# EAGLE schematic untitled (EAGLE 6.1)
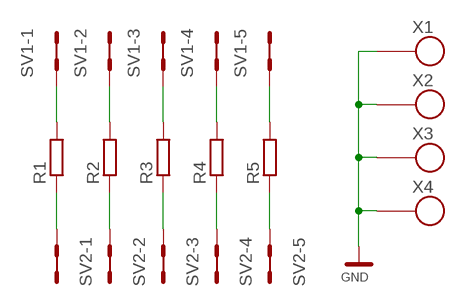
[diagram p0: schematic, sheet 1]

## Parts
R1  R0805  [0805]
R2  R0805  [0805]
R3  R0805  [0805]
R4  R0805  [0805]
R5  R0805  [0805]
SV1  MA05-2  [MA05-2]
SV2  MA05-2  [MA05-2]
X1  SROUB3M  [SROUB3M]
X2  SROUB3M  [SROUB3M]
X3  SROUB3M  [SROUB3M]
X4  SROUB3M  [SROUB3M]

## Nets
GND: X1.P$1 X2.P$1 X3.P$1 X4.P$1
N$1: R1.1 SV2.1 SV2.2
N$2: R2.1 SV2.3 SV2.4
N$3: R3.1 SV2.5 SV2.6
N$4: R4.1 SV2.7 SV2.8
N$5: R1.2 SV1.1 SV1.2
N$6: R2.2 SV1.3 SV1.4
N$7: R3.2 SV1.5 SV1.6
N$8: R4.2 SV1.7 SV1.8
N$9: R5.1 SV2.9 SV2.10
N$10: R5.2 SV1.9 SV1.10

## Library data of the parts
R1-R5 = moje_R:R0805
SV1 SV2 = moje_hrebinky:MA05-2: PIN HEADER; OC_FARNELL: unknown; OC_NEWARK: unknown
X1-X4 = moje:SROUB3M